# Altium project Etage Reception 2.PrjPcb
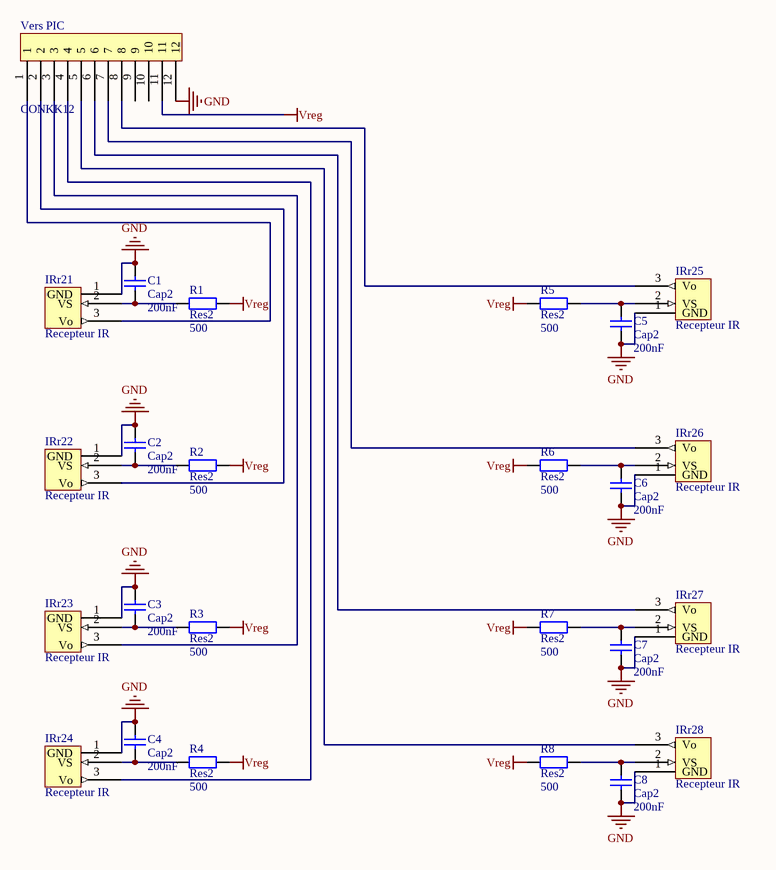
[diagram p0: Etage Reception 2.SchDoc]
1 sheet, 25 parts. Net scope: global (net labels, ports and power ports of the same name join across sheets).
Board file: Etage Reception 2.PcbDoc

## Sheet Etage Reception 2.SchDoc
size A4

### Parts
C1  Cap2  value 200nF  [CAPA2]
C2  Cap2  value 200nF  [CAPA2]
C3  Cap2  value 200nF  [CAPA2]
C4  Cap2  value 200nF  [CAPA2]
C5  Cap2  value 200nF  [CAPA2]
C6  Cap2  value 200nF  [CAPA2]
C7  Cap2  value 200nF  [CAPA2]
C8  Cap2  value 200nF  [CAPA2]
IRr21  Recepteur IR  [TSOP1138]
IRr22  Recepteur IR  [TSOP1138]
IRr23  Recepteur IR  [TSOP1138]
IRr24  Recepteur IR  [TSOP1138]
IRr25  Recepteur IR  [TSOP1138]
IRr26  Recepteur IR  [TSOP1138]
IRr27  Recepteur IR  [TSOP1138]
IRr28  Recepteur IR  [TSOP1138]
R1  Res2  value 500  [res5_1/4W]
R2  Res2  value 500  [res5_1/4W]
R3  Res2  value 500  [res5_1/4W]
R4  Res2  value 500  [res5_1/4W]
R5  Res2  value 500  [res5_1/4W]
R6  Res2  value 500  [res5_1/4W]
R7  Res2  value 500  [res5_1/4W]
R8  Res2  value 500  [res5_1/4W]
Vers_PIC  CONKK12  [CONKK12]

### Nets
GND: C1.2 C2.2 C3.2 C4.2 C5.2 C6.2 C7.2 C8.2 IRr21.1(GND) IRr22.1(GND) IRr23.1(GND) IRr24.1(GND) IRr25.1(GND) IRr26.1(GND) IRr27.1(GND) IRr28.1(GND) Vers_PIC.12
Vreg: R1.2 R2.2 R3.2 R4.2 R5.2 R6.2 R7.2 R8.2 Vers_PIC.11
NetC1_1: C1.1 IRr21.2(VS) R1.1
NetC2_1: C2.1 IRr22.2(VS) R2.1
NetC3_1: C3.1 IRr23.2(VS) R3.1
NetC4_1: C4.1 IRr24.2(VS) R4.1
NetC5_1: C5.1 IRr25.2(VS) R5.1
NetC6_1: C6.1 IRr26.2(VS) R6.1
NetC7_1: C7.1 IRr27.2(VS) R7.1
NetC8_1: C8.1 IRr28.2(VS) R8.1
NetIRr21_3: IRr21.3(Vo) Vers_PIC.1
NetIRr22_3: IRr22.3(Vo) Vers_PIC.2
NetIRr23_3: IRr23.3(Vo) Vers_PIC.3
NetIRr24_3: IRr24.3(Vo) Vers_PIC.4
NetIRr25_3: IRr25.3(Vo) Vers_PIC.8
NetIRr26_3: IRr26.3(Vo) Vers_PIC.7
NetIRr27_3: IRr27.3(Vo) Vers_PIC.6
NetIRr28_3: IRr28.3(Vo) Vers_PIC.5

Not connected (* = marked no-connect by the designer): Vers_PIC 9 10

### Library data of the parts
C1-C8 = Cap2: Capacitor; Published: 8-Jun-2000; LatestRevisionDate: 17-Jul-2002; LatestRevisionNote: Re-released for DXP Platform.; PackageReference: RAD-0.3; Publisher: Altium Limited
IRr21-IRr28 = TSOP1138: pin to pad: 1>GND 2>Vs 3>Vo
R1-R8 = Res2: Resistor; Published: 8-Jun-2000; LatestRevisionDate: 17-Jul-2002; LatestRevisionNote: Re-released for DXP Platform.; PackageReference: AXIAL-0.4; Publisher: Altium Limited